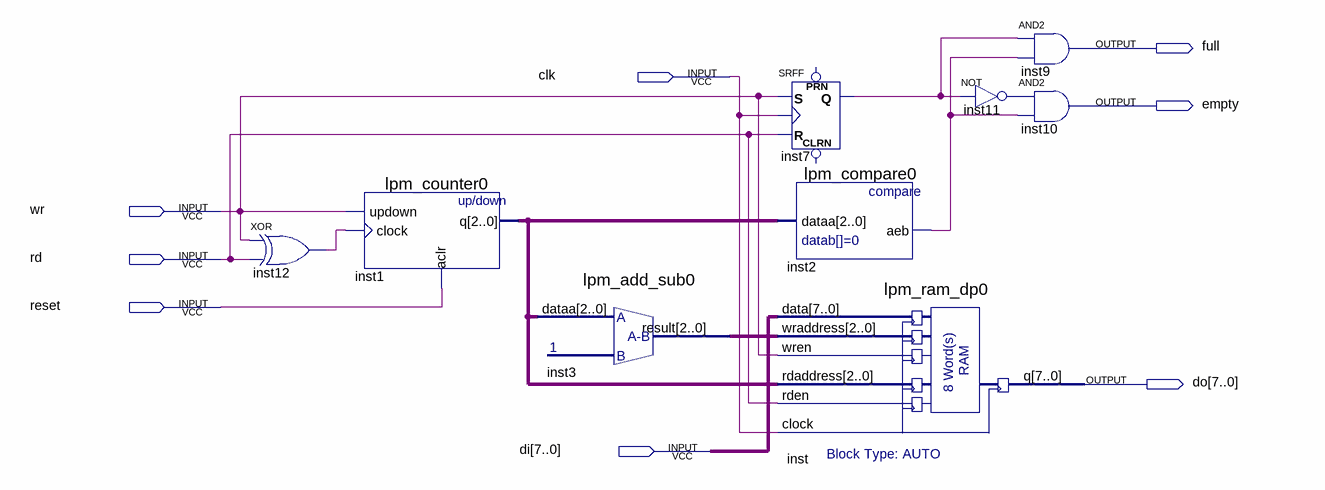
[diagram p0: schematic sheet]
// Quartus schematic lifog.bdf as structural Verilog: 9 symbols, 8 pins
module lifog (
  input  clk,
  input  wr,
  input  rd,
  input  reset,
  input  [7:0] di,
  output full,
  output empty,
  output [7:0] \do 
);

  wire inst2_aeb, inst7_q, inst11_out, inst12_out;
  wire [2:0] inst1_q, inst3_result;

  xor inst12 (inst12_out, wr, rd);
  lpm_counter0 inst1 (.updown(wr), .clock(inst12_out), .aclr(reset), .q(inst1_q));
  lpm_add_sub0 inst3 (.dataa(inst1_q), .result(inst3_result));
  SRFF inst7 (.S(wr), .R(rd), .CLK(clk), .Q(inst7_q));  // open: PRN, CLRN
  lpm_compare0 inst2 (.dataa(inst1_q), .aeb(inst2_aeb));
  lpm_ram_dp0 inst (
    .data(di), .wraddress(inst3_result), .wren(wr), .rdaddress(inst1_q), .rden(rd), .clock(clk), .q(\do ));
  and inst9 (full, inst7_q, inst2_aeb);
  and inst10 (empty, inst11_out, inst2_aeb);
  not inst11 (inst11_out, inst7_q);
endmodule
